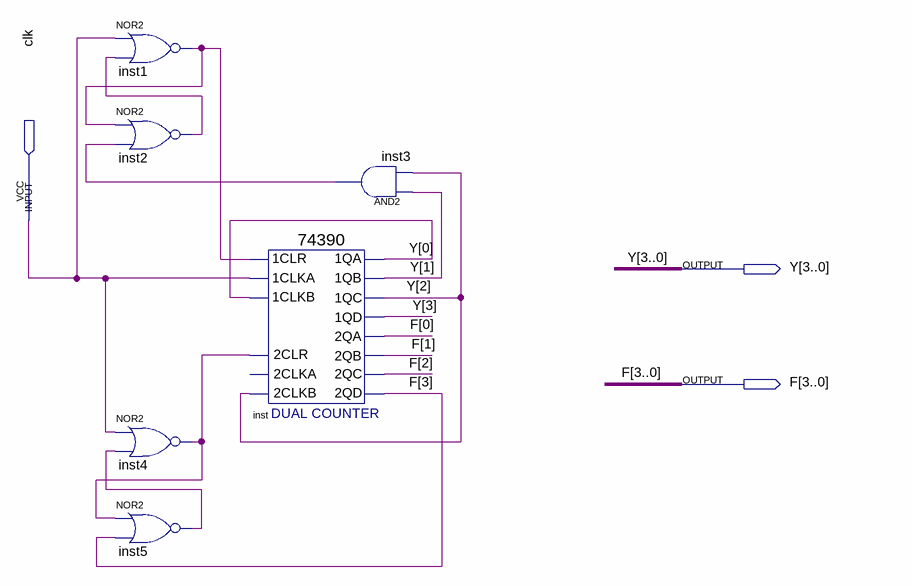
[diagram p0: schematic sheet]
// Quartus schematic lab3.bdf as structural Verilog: 6 symbols, 3 pins
module lab3 (
  input  clk,
  output [3:0] Y,
  output [3:0] F
);

  wire inst1_out, inst2_out, inst3_out, inst4_out, inst5_out;

  nor inst1 (inst1_out, clk, inst2_out);
  nor inst2 (inst2_out, inst1_out, inst3_out);
  nor inst4 (inst4_out, clk, inst5_out);
  nor inst5 (inst5_out, inst4_out, F[3]);
  \74390  inst (
    .\2CLR (inst4_out), .\2CLKB (Y[2]), .\1CLR (inst1_out), .\1CLKA (clk), .\1CLKB (Y[0]), .\1QA (Y[0]),
    .\1QB (Y[1]), .\1QC (Y[2]), .\1QD (Y[3]), .\2QA (F[0]), .\2QB (F[1]), .\2QC (F[2]), .\2QD (F[3]));  // open: 2CLKA
  and inst3 (inst3_out, Y[1], Y[2]);
endmodule
